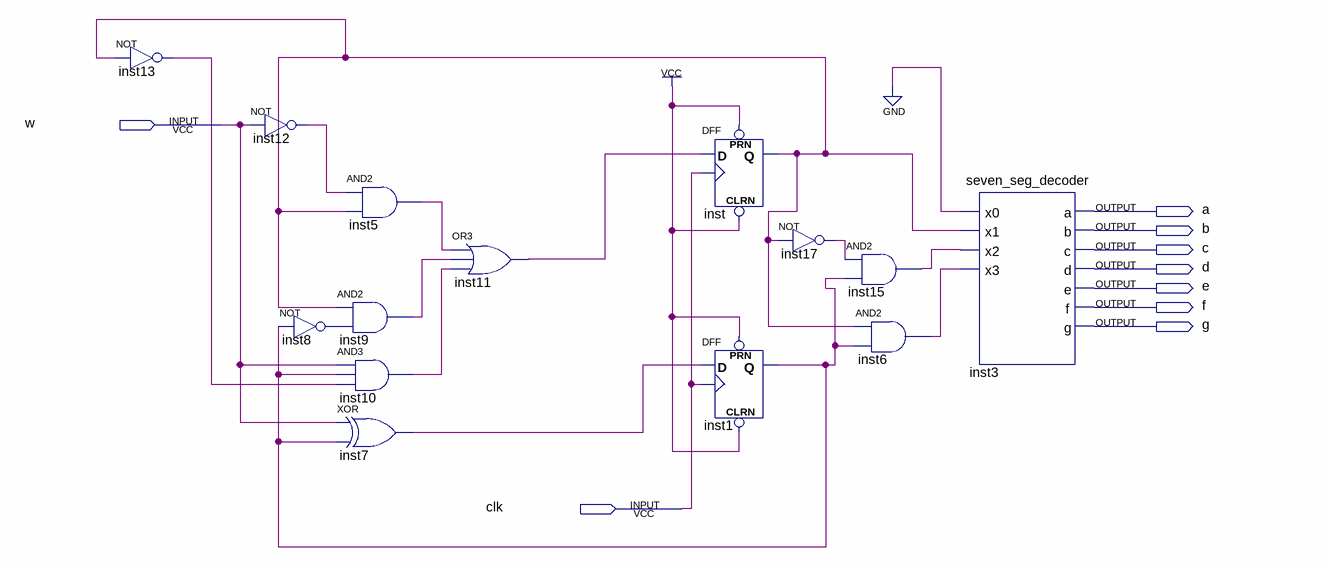
[diagram p0: schematic sheet]
// Quartus schematic Lab11step2.bdf as structural Verilog: 14 symbols, 9 pins
module Lab11step2 (
  input  w,
  input  clk,
  output a,
  output b,
  output c,
  output d,
  output e,
  output f,
  output g
);

  wire inst1_q, inst5_out, inst6_out, inst7_out, inst8_out, inst9_out, inst10_out, inst11_out, inst12_out,
       inst13_out, inst15_out, inst17_out, inst_q;

  not inst13 (inst13_out, inst_q);
  not inst12 (inst12_out, w);
  not inst8 (inst8_out, inst1_q);
  and inst5 (inst5_out, inst12_out, inst_q);
  and inst9 (inst9_out, inst_q, inst8_out);
  and inst10 (inst10_out, w, inst1_q, inst13_out);
  xor inst7 (inst7_out, w, inst1_q);
  or inst11 (inst11_out, inst5_out, inst9_out, inst10_out);
  DFF inst (.CLRN(1'b1), .CLK(clk), .D(inst11_out), .PRN(1'b1), .Q(inst_q));
  DFF inst1 (.CLRN(1'b1), .CLK(clk), .D(inst7_out), .PRN(1'b1), .Q(inst1_q));
  not inst17 (inst17_out, inst_q);
  and inst15 (inst15_out, inst17_out, inst1_q);
  and inst6 (inst6_out, inst_q, inst1_q);
  seven_seg_decoder inst3 (
    .x0(1'b0), .x1(inst_q), .x2(inst15_out), .x3(inst6_out), .a(a), .b(b), .c(c), .d(d), .e(e), .f(f), .g(g));
endmodule
